# EAGLE design Convertidor4bits (EAGLE 7.7.0)
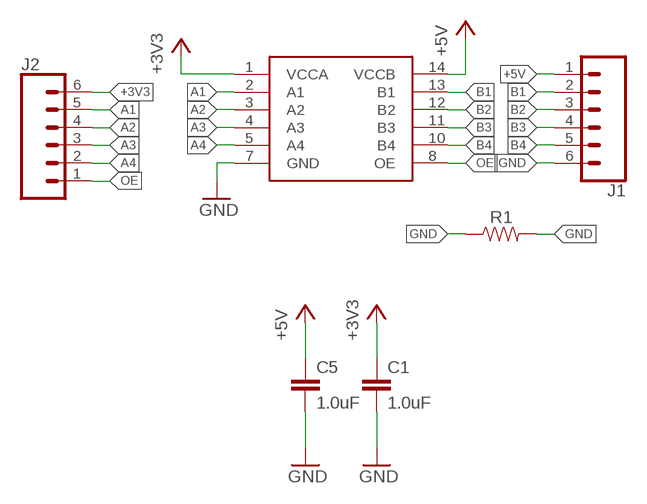
[diagram p0: schematic, sheet 1]

## Parts
C1  1.0uF  1.0UF-0805-25V-(+80/-20%)  [0805]
C5  1.0uF  1.0UF-0805-25V-(+80/-20%)  [0805]
IC1  TXB0104  [SO14]
J1  CONN_06LONGPADS  [1X06_LONGPADS]
J2  CONN_06LONGPADS  [1X06_LONGPADS]
R1  RESISTOR0805  [0805]

## Nets
+3V3: C1.1 IC1.1(VCCA) J2.6
+5V: C5.1 IC1.14(VCCB) J1.1
A1: IC1.2(A1) J2.5
A2: IC1.3(A2) J2.4
A3: IC1.4(A3) J2.3
A4: IC1.5(A4) J2.2
B1: IC1.13(B1) J1.2
B2: IC1.12(B2) J1.3
B3: IC1.11(B3) J1.4
B4: IC1.10(B4) J1.5
GND: C1.2 C5.2 IC1.7(GND) J1.6 R1.1 R1.2
OE: IC1.8(OE) J2.1

## Library data of the parts
C1 C5 = SparkFun-Capacitors:1.0UF: 1µF ceramic capacitors A capacitor is a passive two-terminal electrical component used to store electrical energy temporarily in an electric field.; PROD_ID: CAP-11625
IC1 = Componentes:TXB0104
J1 J2 = SparkFun-Connectors:CONN_06: Multi connection point. Often used as Generic Header-pin footprint for 0.1 inch spaced/style header connections On any of the 0.1 inch spaced packages, you can populate with these: Break Away Headers - Straight <https://www.sparkfun.com/products/116> (PRT-00116) Break Away Male Headers - Right Angle <https://www.sparkfun.com/products/553> (PRT-00553) Female Headers <https://www.sparkfun.com/products/115> (PRT-00115) Break Away Headers - Machine Pin <https://www.sparkfun.com/products/117> (PRT-00117) Break Away Female Headers - Swiss Machine Pin <https://www.sparkfun.com/products/743> (PRT-00743) Arduino Stackable Header - 6 Pin <https://www.sparkfun.com/products/9280> (PRT-09280) For SCREWTERMINALS and SPRING TERMINALS visit here: Screw Terimnals on SparkFun.com <https://www.sparkfun.com/search/results?term=Screw+Terminals> (5mm/3.5mm/2.54mm spacing) This device is also useful as a general connection point to wire up your design to another part of your project. Our various solder wires solder well into these plated through hole pads. Hook-Up Wire - Assortment (Stranded, 22 AWG) <https://www.sparkfun.com/products/11375> (PRT-11375) Hook-Up Wire - Assortment (Solid Core, 22 AWG) <https://www.sparkfun.com/products/11367> (PRT-11367) View the entire wire category on our website here <https://www.sparkfun.com/categories/141>
R1 = SparkFun-Resistors:RESISTOR: Generic Resistor Package

## Board
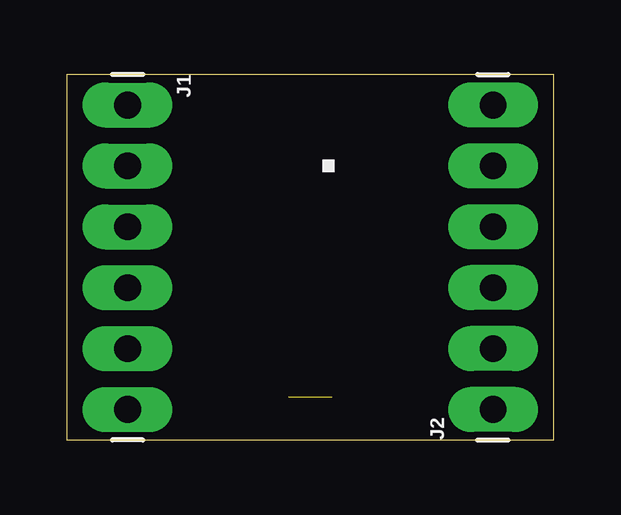
[diagram p1: board, top side]
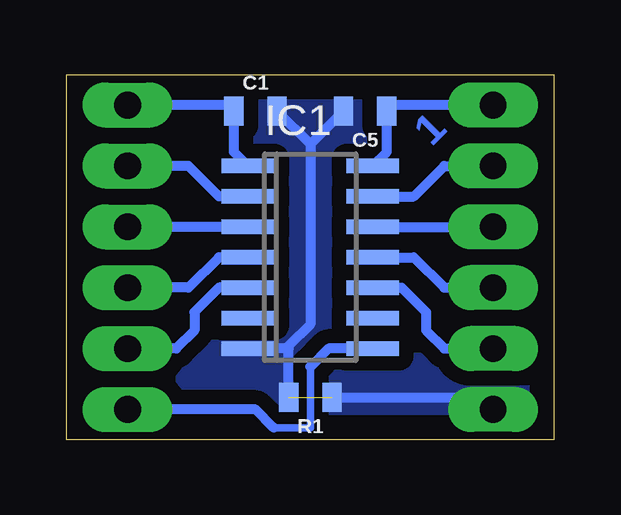
[diagram p2: board, bottom side, seen from below]

Size 20.32 x 15.24 mm. Coordinates in mm from the lower left corner, seen from the top.
Outline: 0,0 20.32,0 20.32,15.24 0,15.24 0,0
Copper layers (1*16): Top 0.035mm / dielectric 1.5mm / Bottom 0.035mm
Design rules "default": minimum track width 10mil, minimum drill 24mil, track to track 8mil, track to pad 8mil, pad to pad 8mil, via to via 8mil, smd to smd 8mil, copper to edge 40mil, drill to drill 8mil, minimum pad ring 10mil, minimum via ring 8mil, stop-mask expansion 4mil, vias tented up to drill 0mil, thermal gap 10mil

### Footprints (pad centres in the part's own frame; a part is rotated, then mirrored left to right if it is on the bottom)
0805 = smd 0.8 x 1.2: 1 -0.9,0; 2 0.9,0
SO14 = smd 0.6 x 2.2: 1 -3.81,-2.6; 2 -2.54,-2.6; 3 -1.27,-2.6; 4 0,-2.6; 5 1.27,-2.6; 6 2.54,-2.6; 7 3.81,-2.6; 8 3.81,2.6; 9 2.54,2.6; 10 1.27,2.6; 11 0,2.6; 12 -1.27,2.6; 13 -2.54,2.6; 14 -3.81,2.6
1X06_LONGPADS = drill 1.118 pad 1.88 long: 1 0,0; 2 2.54,0; 3 5.08,0; 4 7.62,0; 5 10.16,0; 6 12.7,0

### Placement (x,y rotation side)
C1  12.45,13.72 0 bottom
C5  7.87,13.72 180 bottom
IC1  10.16,7.62 270 bottom
J1  2.54,13.97 270 top
J2  17.78,1.27 90 top
R1  10.16,1.78 180 bottom

### Tracks (layer width: path | path; a pad name or v marks a point on that pad's centre or on a via)
+3V3
  Bottom 0.406: IC1.1 13.35,12.02 C1.1 13.6,13.97 J2.6
+5V
  Bottom 0.406: J1.1 6.72,13.97 C5.1 6.97,12.02 IC1.14
A1
  Bottom 0.406: IC1.2 13.97,10.16 15.24,11.43 J2.5
A2
  Bottom 0.406: IC1.3 J2.4
A3
  Bottom 0.406: IC1.4 13.97,7.62 15.24,6.35 J2.3
A4
  Bottom 0.406: IC1.5 13.97,6.35 14.99,5.33 14.99,4.57 15.75,3.81 J2.2
B1
  Bottom 0.406: IC1.13 5.84,10.16 4.57,11.43 J1.2
B2
  Bottom 0.406: IC1.12 J1.3
B3
  Bottom 0.406: IC1.11 5.84,7.62 4.57,6.35 J1.4
B4
  Bottom 0.406: IC1.10 6.35,6.35 5.33,5.33 5.33,4.57 4.57,3.81 J1.5
GND  (1 unrouted)
  Bottom 0.406: R1.2 11.06,3.81 | 11.06,3.81 IC1.7 | R1.1 3.05,1.78 J1.6 | C1.2 10.16,12.33 | 10.16,12.33 10.16,4.83 11.06,3.93 11.06,3.81 | C5.2 10.16,12.33
  pour Bottom (isolate 0.61, no thermals): 0,0 0,15.24 20.32,15.24 20.32,0
OE
  Bottom 0.305: 10.16,3.05 10.16,0.51 11.68,0.51
  Bottom 0.406: IC1.8 9.4,3.81 10.16,3.05 | 11.68,0.51 12.45,1.27 J2.1

### Text on the board
Bottom: 1